# EAGLE design RF1_SSR4_ADD_ON_V3 (EAGLE 7.3.0)
RS485/Renard adapter for the RF1
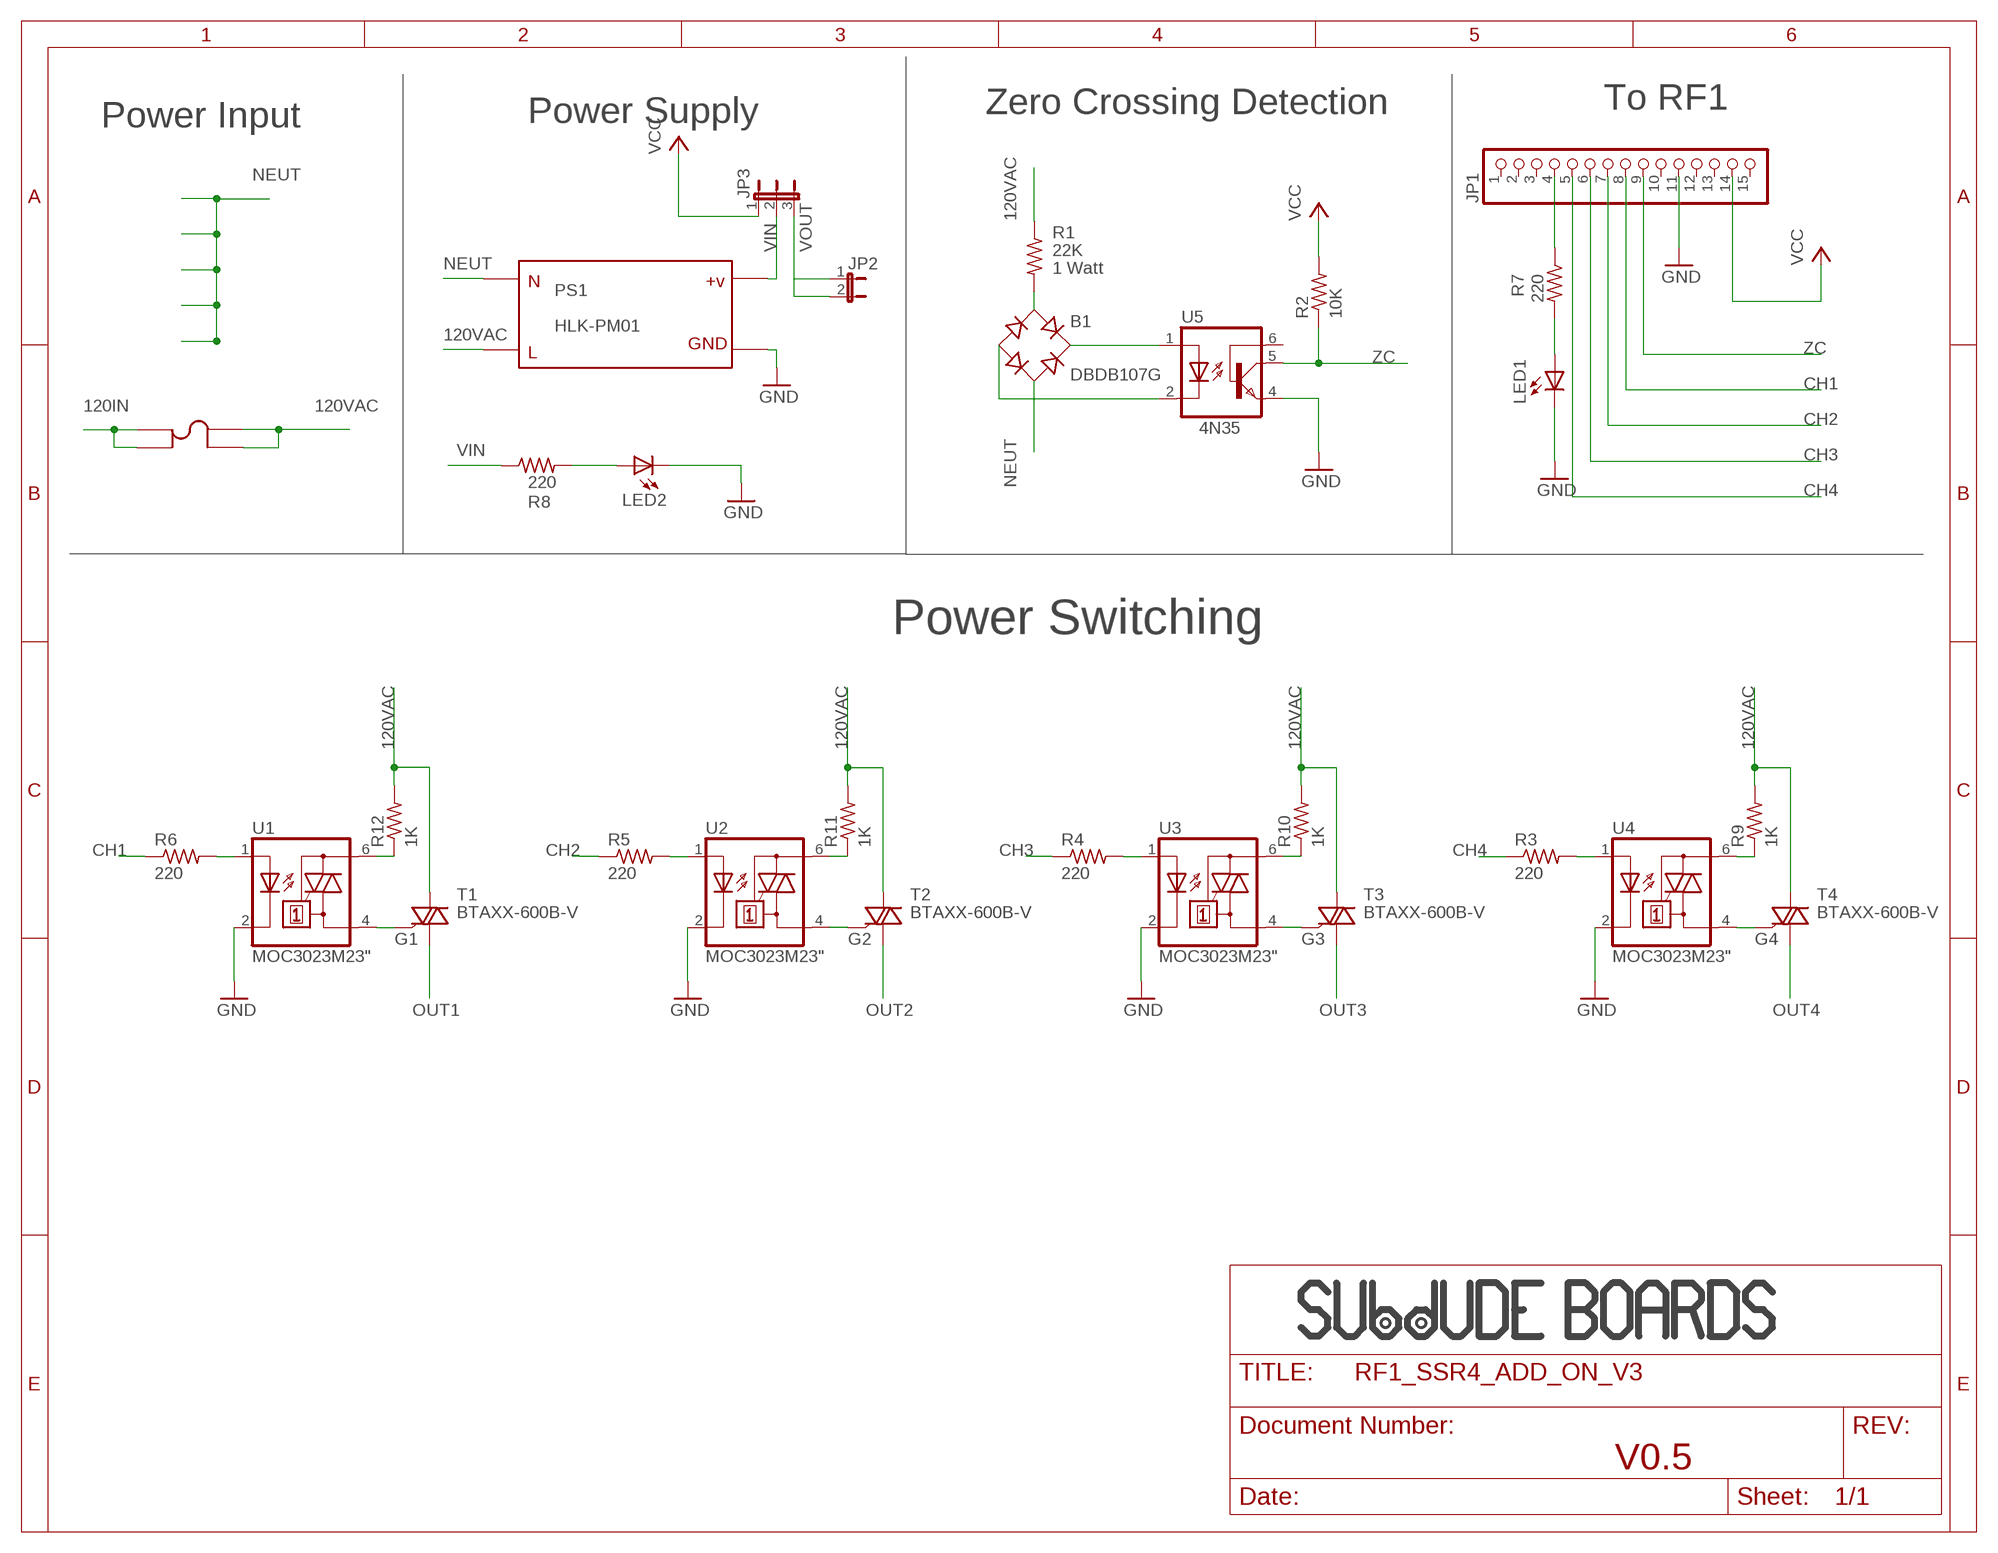
[diagram p0: schematic, sheet 1]

## Parts
B1  DBDB107G  [DB]
F1  FUSE5MMPCB  [KE3517]
JP1  PINHD-1X15  [1X15]
JP2  JP1E  [JP1]
JP3  JP2E  [JP2]
LED1  LED3MM  [LED3MM]
LED2  LED3MM  [LED3MM]
PS1  HLK-PM01  [HLK-PM01-STD]
R1  22K  R-US_0617/5V  [0617V]
R2  10K  R-US_0207/7  [0207/7]
R3  220  R-US_0207/2V  [0207/2V]
R4  220  R-US_0207/2V  [0207/2V]
R5  220  R-US_0207/2V  [0207/2V]
R6  220  R-US_0207/2V  [0207/2V]
R7  220  R-US_0207/2V  [0207/2V]
R8  220  R-US_0207/2V  [0207/2V]
R9  1K  R-US_0207/2V  [0207/2V]
R10  1K  R-US_0207/2V  [0207/2V]
R11  1K  R-US_0207/2V  [0207/2V]
R12  1K  R-US_0207/2V  [0207/2V]
T1  BTAXX-600B-V  [TO220BV]
T2  BTAXX-600B-V  [TO220BV]
T3  BTAXX-600B-V  [TO220BV]
T4  BTAXX-600B-V  [TO220BV]
U1  MOC3023M23"  [DIL06A]
U2  MOC3023M23"  [DIL06A]
U3  MOC3023M23"  [DIL06A]
U4  MOC3023M23"  [DIL06A]
U5  4N35SMALL  [DIL06A]
U$1  SUBDUDE_LOGOLARGE  [SUBDUDE_LARGE]
U$2  SUBDUDE_LOGOLARGE  [SUBDUDE_LARGE]

## Nets
120IN: F1.P$1 F1.P$3
120VAC: F1.P$2 F1.P$4 PS1.AC_L R1.1 R9.2 R10.2 R11.2 R12.2 T1.T2(A2) T2.T2(A2) T3.T2(A2) T4.T2(A2)
CH1: JP1.8 R6.1
CH2: JP1.7 R5.1
CH3: JP1.6 R4.1
CH4: JP1.5 R3.1
G1: T1.G U1.4(A1)
G2: T2.G U2.4(A1)
G3: T3.G U3.4(A1)
G4: T4.G U4.4(A1)
GND: JP1.11 LED1.K(C) LED2.K(C) PS1.VO- U1.2(C) U2.2(C) U3.2(C) U4.2(C) U5.4(EMI)
N$1: LED1.A R7.2
N$2: B1.AC1 R1.2
N$3: JP1.4 R7.1
N$4: LED2.A R8.2
N$5: B1.+ U5.1(A)
N$6: B1.- U5.2(C)
N$7: R4.2 U3.1(A)
N$14: R5.2 U2.1(A)
N$15: R6.2 U1.1(A)
N$18: R9.1 U4.6(A2)
N$19: R10.1 U3.6(A2)
N$20: R11.1 U2.6(A2)
N$21: R12.1 U1.6(A2)
NEUT: B1.AC2 PS1.AC_N
OUT1: T1.T1(A1)
OUT2: T2.T1(A1)
OUT3: T3.T1(A1)
OUT4: T4.T1(A1)
QQQQ: R3.2 U4.1(A)
VCC: JP1.14 JP3.1 R2.2
VIN: JP3.2 PS1.VO+ R8.1
VOUT: JP2.1 JP2.2 JP3.3
ZC: JP1.9 R2.1 U5.5(COL)
Unconnected: JP1.1 JP1.2 JP1.3 JP1.10 JP1.12 JP1.13 JP1.15 U5.6(BAS)

## Notes on the sheet
- Zero Crossing Detection | To RF1
- Power Input | Power Supply
- 1 Watt
- 4N35
- Power Switching
- V0.5

## Library data of the parts
B1 = tim:DB?*G: Single Phase 1.0 AMP Glass Passivated Bridge Rectifier Taiwan Semiconductor Co.,Ltd. - TSC Source: http://www.taiwansemi.com/TSCbig5/ezcatfiles/cust/img/img/db101g.pdf http://www.ts.com.tw/db/pictures/modules/PDT/PDT060207001/DBLS201G.pdf
F1 = tim:FUSE5MMPCB: Keystone Electronics 3517
JP1 = adafruit:PINHD-1X15: PIN HEADER
JP2 = tim:JP1E: JUMPER
JP3 = tim:JP2E: JUMPER
LED1 LED2 = adafruit:LED: LED OSRAM: - CHIPLED LG R971, LG N971, LY N971, LG Q971, LY Q971, LO R971, LY R971 LH N974, LH R974 LS Q976, LO Q976, LY Q976 LO Q996 - Hyper CHIPLED LW Q18S LB Q993, LB Q99A, LB R99A - SideLED LS A670, LO A670, LY A670, LG A670, LP A670 LB A673, LV A673, LT A673, LW A673 LH A674 LY A675 LS A676, LA A676, LO A676, LY A676, LW A676 LS A679, LY A679, LG A679 - Hyper Micro SIDELED® LS Y876, LA Y876, LO Y876, LY Y876 LT Y87S - SmartLED LW L88C, LW L88S LB L89C, LB L89S, LG L890 LS L89K, LO L89K, LY L89K LS L896, LA L896, LO L896, LY L896 - TOPLED LS T670, LO T670, LY T670, LG T670, LP T670 LSG T670, LSP T670, LSY T670, LOP T670, LYG T670 LG T671, LOG T671, LSG T671 LB T673, LV T673, LT T673, LW T673 LH T674 LS T676, LA T676, LO T676, LY T676, LB T676, LH T676, LSB T676, LW T676 LB T67C, LV T67C, LT T67C, LS T67K, LO T67K, LY T67K, LW E67C LS E67B, LA E67B, LO E67B, LY E67B, LB E67C, LV E67C, LT E67C LW T67C LS T679, LY T679, LG T679 LS T770, LO T770, LY T770, LG T770, LP T770 LB T773, LV T773, LT T773, LW T773 LH T774 LS E675, LA E675, LY E675, LS T675 LS T776, LA T776, LO T776, LY T776, LB T776 LHGB T686 LT T68C, LB T68C - Hyper Mini TOPLED® LB M676 - Mini TOPLED Santana® LG M470 LS M47K, LO M47K, LY M47K Source: http://www.osram.convergy.de/
PS1 = tim:HLK-PM01
R1-R12 = resistor:R-US_: RESISTOR, American symbol
T1-T4 = tim:BTAXX-600B
U1-U4 = tim:MOC3023M
U5 = tim:4N35: MOTOROLA OPTO COUPLER
U$1 U$2 = tim:SUBDUDE_LOGO

## Board
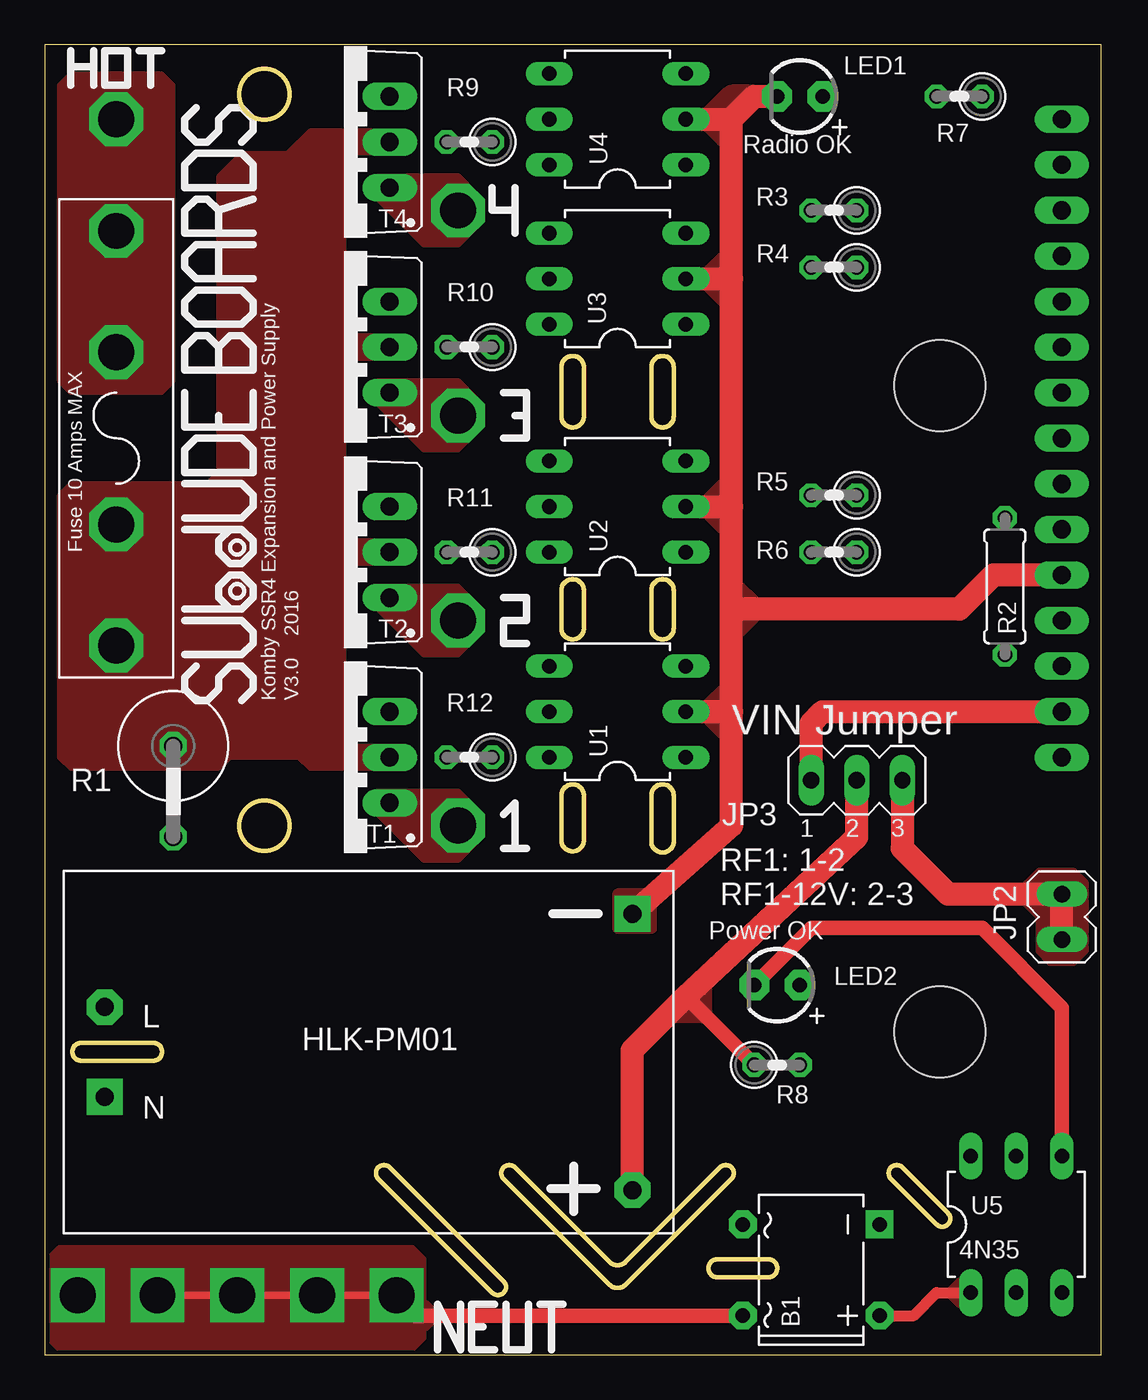
[diagram p1: board, top side]
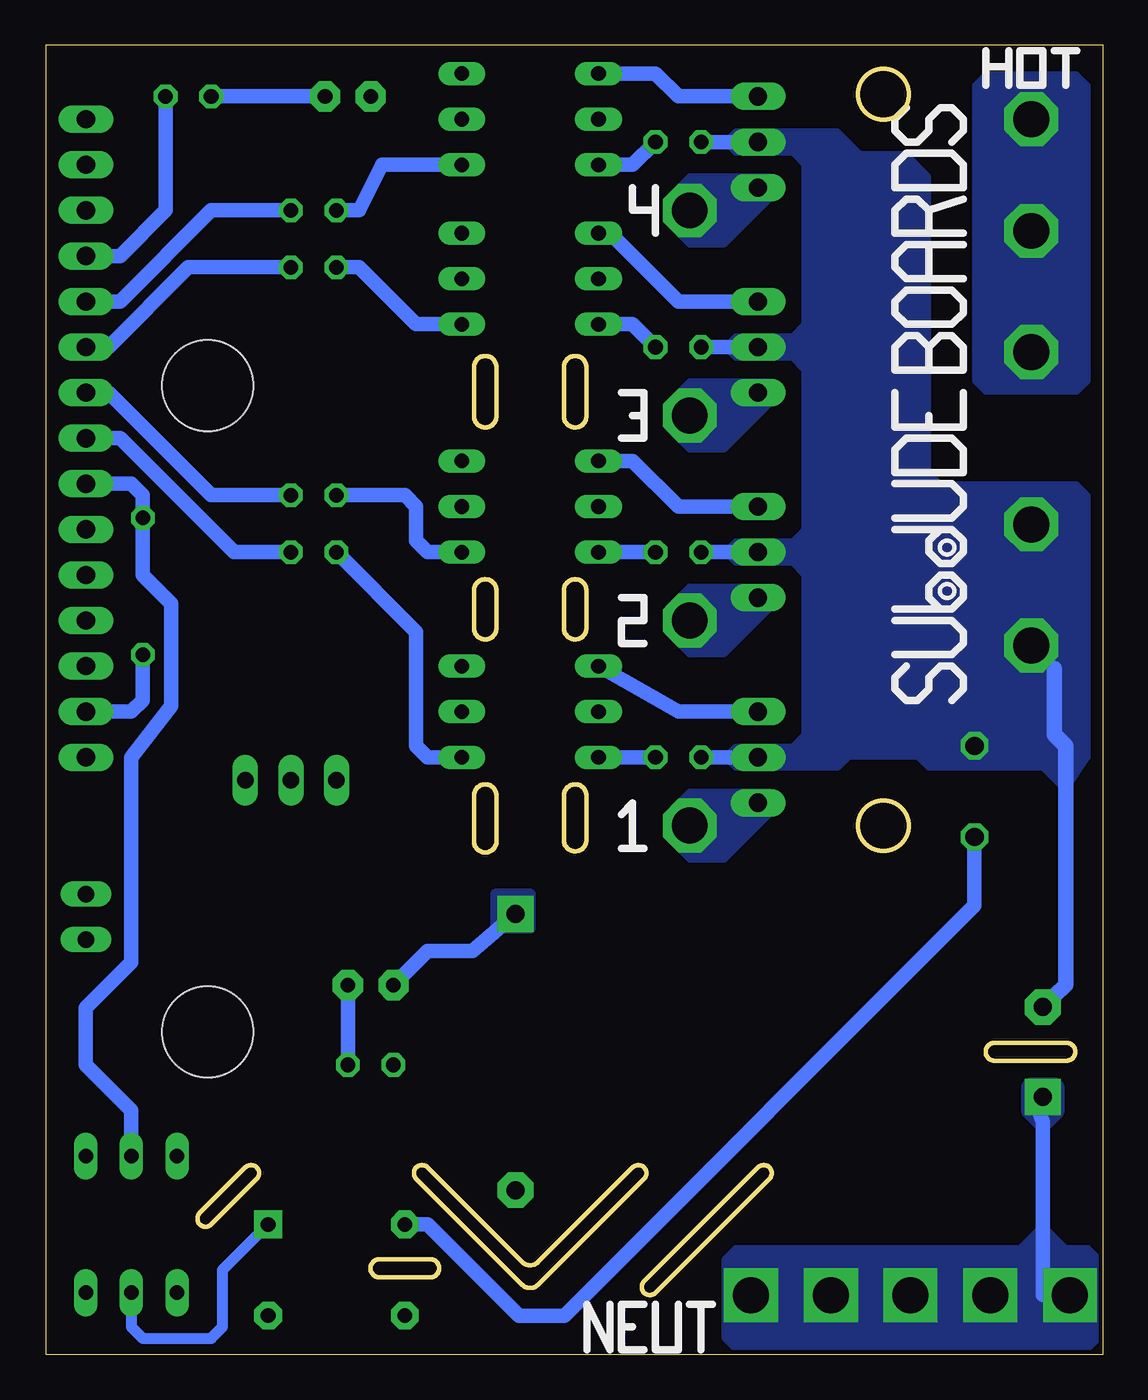
[diagram p2: board, bottom side, seen from below]

Size 58.89 x 73 mm. Coordinates in mm from the lower left corner, seen from the top.
Outline: 0,73 0,0 58.89,0 58.89,73 0,73
Copper layers (1*16): Top 0.035mm / dielectric 1.5mm / Bottom 0.035mm
Design rules "dirty": minimum track width 5mil, minimum drill 12mil, track to track 5mil, track to pad 5mil, pad to pad 5mil, via to via 5mil, smd to smd 0mil, copper to edge 10mil, drill to drill 10mil, minimum pad ring 10mil, minimum via ring 6mil, stop-mask expansion 2mil, vias tented up to drill 25mil, thermal gap 10mil
Holes 5.08 mm at 49.89,54 49.89,18
Milling: area 10.8,28.1 to 13.6,30.9; area 10.8,68.9 to 13.6,71.6; 49 lines

### Footprints (pad centres in the part's own frame; a part is rotated, then mirrored left to right if it is on the bottom)
DB = drill 0.813 pad 1.549 octagon: + -2.54,-3.81; AC1 2.54,3.81; AC2 -2.54,3.81 | drill 0.813 pad 1.549 square: - 2.54,-3.81
KE3517 = drill 2 octagon: P$1 -11.557,0; P$2 11.557,0; P$3 -4.801,0; P$4 4.801,0
1X15 = drill 1.016 long: 1 -17.78,0; 2 -15.24,0; 3 -12.7,0; 4 -10.16,0; 5 -7.62,0; 6 -5.08,0; 7 -2.54,0; 8 0,0; 9 2.54,0; 10 5.08,0; 11 7.62,0; 12 10.16,0; 13 12.7,0; 14 15.24,0; 15 17.78,0
JP1 = drill 0.914 long: 1 0,-1.27; 2 0,1.27
JP2 = drill 0.914 long: 1 -2.54,0; 2 0,0; 3 2.54,0
LED3MM = drill 0.813 pad 1.676 octagon: A -1.27,0; K 1.27,0
HLK-PM01-STD = drill 1 pad 2 octagon: AC_L -14.795,2.42; VO+ 14.605,-7.78 | drill 1 pad 2 square: AC_N -14.795,-2.58; VO- 14.605,7.62
0617V = drill 1.016 octagon: 1 -2.54,0; 2 2.54,0
0207/7 = drill 0.813 octagon: 1 -3.81,0; 2 3.81,0
0207/2V = drill 0.813 octagon: 1 -1.27,0; 2 1.27,0
TO220BV = drill 1.016 long: G 2.54,-2.54; T1 -2.54,-2.54; T2 0,-2.54
DIL06A = drill 0.813 long: 1 -2.54,-3.81; 2 0,-3.81; 3 2.54,-3.81; 4 2.54,3.81; 5 0,3.81; 6 -2.54,3.81

### Placement (x,y rotation side)
B1  42.71,4.72 90 top
F1  3.98,51.08 270 top
JP1  56.68,51.08 270 top
JP2  56.68,24.4 0 top
JP3  45.25,32.03 0 top
LED1  42.08,70.12 180 top
LED2  40.81,20.59 180 top
PS1  18.14,16.95 0 top
R1  7.16,31.39 270 top
R2  53.51,42.82 270 top
R3  43.98,63.77 180 top
R4  43.98,60.6 180 top
R5  43.98,47.9 180 top
R6  43.98,44.73 180 top
R7  50.97,70.12 180 top
R8  40.81,16.15 0 top
R9  23.66,67.58 180 top
R10  23.66,56.16 180 top
R11  23.66,44.73 180 top
R12  23.66,33.3 180 top
T1  16.68,33.3 90 top
T2  16.68,44.73 90 top
T3  16.68,56.16 90 top
T4  16.68,67.58 90 top
U1  31.92,35.84 90 top
U2  31.92,47.27 90 top
U3  31.92,59.97 90 top
U4  31.92,68.85 90 top
U5  54.14,7.26 0 top
U$1  11.6,36.47 90 top
U$2  7.79,36.47 90 bottom

### Tracks (layer width: path | path; a pad name or v marks a point on that pad's centre or on a via)
120IN  (via drill 2)
  other vias: 3.98,68.85
  pour Top (no thermals): 6.52,71.39 1.44,71.39 0.8,70.76 0.8,54.25 1.44,53.62 6.52,53.62 7.16,54.25 7.16,70.76
  pour Bottom (no thermals): 1.44,71.39 0.8,70.76 0.8,54.25 1.44,53.62 6.52,53.62 7.16,54.25 7.16,70.76 6.52,71.39
120VAC
  Bottom 0.61: 2.71,38.25 F1.P$2
  Bottom 0.813: R10.2 T3.T2 | R9.2 T4.T2 | R11.2 T2.T2 | R12.2 T1.T2
  Bottom 0.864: PS1.AC_L 2.07,20.59 2.07,33.93 2.71,34.57 2.71,38.25
  pour Top (no thermals): 9.06,48.54 1.44,48.54 0.8,47.9 0.8,33.3 1.44,32.66 9.7,32.66 10.33,33.3 14.14,33.3 14.78,32.66 19.85,32.66 20.49,33.3 19.85,33.93 17.31,33.93 16.68,34.57 16.68,43.46 17.31,44.09 19.85,44.09 20.49,44.73 19.85,45.36 17.31,45.36 16.68,46 16.68,54.89 17.31,55.52 19.85,55.52 20.49,56.16 19.85,56.79 17.31,56.79 16.68,57.43 16.68,66.31 17.31,66.95 19.85,66.95 20.49,67.58 19.85,68.22 14.78,68.22 13.51,66.95 10.96,66.95 9.7,65.68 9.7,49.17
  pour Bottom (no thermals): 9.06,48.54 1.44,48.54 0.8,47.9 0.8,33.3 2.07,31.39 3.35,32.66 9.7,32.66 10.33,33.3 14.14,33.3 14.78,32.66 20.49,32.66 21.12,33.3 20.49,33.93 17.31,33.93 16.68,34.57 16.68,43.46 17.31,44.09 20.49,44.09 21.12,44.73 20.49,45.36 17.31,45.36 16.68,46 16.68,54.89 17.31,55.52 20.49,55.52 21.12,56.16 20.49,56.79 17.31,56.79 16.68,57.43 16.68,66.31 17.31,66.95 20.49,66.95 21.12,67.58 20.49,68.22 14.78,68.22 13.51,66.95 10.96,66.95 9.7,65.68 9.7,49.17
CH1
  Bottom 0.813: JP1.8 54.78,51.08 48.43,44.73 R6.1
CH2
  Bottom 0.813: JP1.7 55.41,53.62 49.7,47.9 R5.1
CH3
  Bottom 0.813: JP1.6 55.41,56.16 50.97,60.6 R4.1
CH4
  Bottom 0.813: JP1.5 54.78,58.7 49.7,63.77 R3.1
G1
  Bottom 0.813: T1.G 23.66,35.84 U1.4
G2
  Bottom 0.813: T2.G 23.66,47.27 26.2,49.8 U2.4
G3
  Bottom 0.813: T3.G 23.66,58.7 27.47,62.51 U3.4
G4
  Bottom 0.813: U4.4 24.93,71.39 23.66,70.12 T4.G
GND
  Top 0.813: U5.4 56.68,19.32 52.24,23.77 42.71,23.77 LED2.K
  Top 1.27: PS1.VO- 32.74,24.59 | 32.74,24.59 32.55,24.4 | 32.74,24.59 38.27,29.48 38.27,35.84 | 38.27,35.84 38.27,41.55 | 38.27,41.55 38.27,47.27 | 38.27,59.97 38.27,68.85 | 38.27,68.85 39.54,70.12 LED1.K | U4.2 38.27,68.85 | U3.2 38.27,59.97 | U2.2 38.27,47.27 | JP1.11 52.88,43.46 50.97,41.55 38.27,41.55 | U1.2 38.27,35.84 | 38.27,47.27 38.27,59.97
  Bottom 0.813: PS1.VO- 35.12,22.5 37.63,22.5 LED2.K
  pour Top (no thermals): 38.27,42.82 38.27,40.28 39.54,41.55
  pour Top (no thermals): 38.27,46 38.27,48.54 37,47.27
  pour Top (no thermals): 38.27,58.7 38.27,61.23 37,59.97
  pour Top (no thermals): 38.27,67.58 38.27,68.85 39.54,70.12 38.27,70.12 37,68.85
  pour Top (no thermals): 38.27,34.57 38.27,37.11 37,35.84
  pour Bottom (no thermals): 33.82,25.68 31.92,25.68 31.92,23.77 33.82,23.77
  pour Top (no thermals): 33.82,25.68 31.92,25.68 31.92,23.77 33.82,23.77
N$1
  Bottom 0.813: LED1.A R7.2
N$2
  Bottom 0.813: B1.AC1 37.63,7.26 32.55,2.18 30.01,2.18 7.16,25.04 R1.2
N$3
  Bottom 0.813: JP1.4 54.78,61.23 52.24,63.77 R7.1
N$4
  Bottom 0.813: R8.2 LED2.A
N$5
  Top 0.61: B1.+ 48.43,2.18 49.7,3.45 U5.1
  pour Top (no thermals): 51.6,4.08 51.6,2.81 50.97,2.81 50.34,3.45 50.97,4.08
N$6
  Bottom 0.61: U5.2 54.14,1.54 53.51,0.91 49.7,0.91 49.06,1.54 49.06,4.72 B1.-
N$7
  Bottom 0.813: R4.2 41.45,60.6 38.27,57.43 U3.1
N$14
  Bottom 0.813: U2.1 37.63,44.73 38.27,45.36 38.27,47.27 38.91,47.9 R5.2
N$15
  Bottom 0.813: R6.2 38.27,40.28 38.27,33.93 37.63,33.3 U1.1
N$18
  Bottom 0.813: R9.1 26.2,66.31 U4.6
N$19
  Bottom 0.813: R10.1 26.2,57.43 U3.6
N$20
  Bottom 0.813: R11.1 U2.6 28.74,44.73
N$21
  Bottom 0.813: R12.1 U1.6
NEUT  (via drill 2)
  Top 0.406: v19.61,3.3 v15.17,3.3 v10.72,3.3 v6.28,3.3
  Top 0.61: 20.61,2.18 v19.61,3.3
  Top 0.813: B1.AC2 20.61,2.18
  Bottom 0.813: PS1.AC_N 3.85,14.37 3.35,12.98 3.35,3.33
  other vias: 1.83,3.3
  pour Top (no thermals): 0.8,5.99 0.17,5.35 0.17,0.91 0.8,0.28 20.49,0.28 21.12,0.91 21.12,5.35 20.49,5.99
  pour Bottom (no thermals): 3.35,7.26 2.07,5.99 0.8,5.99 0.17,5.35 0.17,0.91 0.8,0.28 20.49,0.28 21.12,0.91 21.12,5.35 20.49,5.99 4.62,5.99
  pour Bottom (no thermals): 3.35,12.98 2.71,13.61 2.71,14.88 3.98,14.88 3.98,13.61
  pour Top (no thermals): 21.12,2.81 21.76,2.18 21.12,1.54
OUT1  (via drill 2)
  other vias: 23.03,29.48
  pour Bottom (no thermals): 17.95,30.75 18.58,31.39 23.03,31.39 24.3,30.12 24.3,28.85 23.03,27.58 21.12,27.58
  pour Top (no thermals): 18.58,31.39 23.03,31.39 24.3,30.12 24.3,28.85 23.03,27.58 21.12,27.58 17.95,30.75
OUT2  (via drill 2)
  other vias: 23.03,40.91
  pour Bottom (no thermals): 17.95,42.19 18.58,42.82 23.03,42.82 24.3,41.55 24.3,40.28 23.03,39.01 21.12,39.01
  pour Top (no thermals): 18.58,42.82 23.03,42.82 24.3,41.55 24.3,40.28 23.03,39.01 21.12,39.01 17.95,42.19
OUT3  (via drill 2)
  other vias: 23.03,52.35
  pour Bottom (no thermals): 17.95,53.62 18.58,54.25 23.03,54.25 24.3,52.98 24.3,51.71 23.03,50.44 21.12,50.44
  pour Top (no thermals): 18.58,54.25 23.03,54.25 24.3,52.98 24.3,51.71 23.03,50.44 21.12,50.44 17.95,53.62
OUT4  (via drill 2)
  other vias: 23.03,63.77
  pour Bottom (no thermals): 17.95,65.05 18.58,65.68 23.03,65.68 24.3,64.41 24.3,63.14 23.03,61.87 21.12,61.87
  pour Top (no thermals): 18.58,65.68 23.03,65.68 24.3,64.41 24.3,63.14 23.03,61.87 21.12,61.87 17.95,65.05
QQQQ
  Bottom 0.813: R3.2 41.45,63.77 40.17,66.31 U4.1
VCC
  Top 1.27: JP3.1 42.71,35.2 43.35,35.84 JP1.14
  Bottom 0.813: JP1.14 54.14,35.84 53.51,36.47 R2.2
VIN
  Top 0.813: R8.1 35.73,19.96
  Top 1.27: PS1.VO+ 32.74,16.97 35.73,19.96 45.25,28.85 JP3.2
  pour Top: 37,18.69 37,21.23 34.46,18.69
VOUT
  Top 1.27: JP2.1 JP2.2 50.34,25.68 47.8,28.21 JP3.3
  pour Top (no thermals): 54.14,25.68 55.41,26.95 57.32,26.95 57.95,26.31 57.95,22.5 57.32,21.86 56.05,21.86 55.41,22.5 55.41,24.4
ZC
  Bottom 0.813: JP1.9 54.14,48.54 53.51,47.9 R2.1 53.51,43.46 51.92,41.87 51.92,36.15 54.14,33.3 54.14,21.86 56.68,19.32 56.68,16.15 54.14,13.61 U5.5

### Text on the board
tPlace: Fuse 10 Amps MAX
tNames: Radio OK | Komby SSR4 Expansion and Power Supply | V3.0 2016 | VIN Jumper | RF1: 1-2 | RF1-12V: 2-3 | Power OK | 4N35
tValues: MOC3023 | MOC3023 | MOC3023 | MOC3023 | 1W